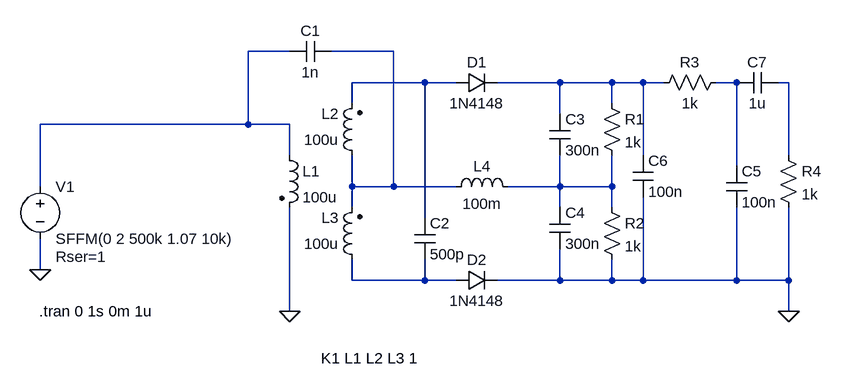
[diagram p0: schematic FMDet.asc]
FMDet.asc, the LTspice schematic file:
Version 4
SHEET 1 1272 680
WIRE 432 -80 368 -80
WIRE 592 -80 496 -80
WIRE 640 -32 528 -32
WIRE 688 -32 640 -32
WIRE 848 -32 752 -32
WIRE 928 -32 848 -32
WIRE 976 -32 928 -32
WIRE 1008 -32 976 -32
WIRE 1120 -32 1088 -32
WIRE 1200 -32 1184 -32
WIRE 528 0 528 -32
WIRE 928 0 928 -32
WIRE 848 16 848 -32
WIRE 368 32 368 -80
WIRE 368 32 48 32
WIRE 432 32 368 32
WIRE 432 80 432 32
WIRE 976 80 976 -32
WIRE 1200 80 1200 -32
WIRE 1120 96 1120 -32
WIRE 48 128 48 32
WIRE 528 128 528 80
WIRE 592 128 592 -80
WIRE 592 128 528 128
WIRE 688 128 592 128
WIRE 848 128 848 80
WIRE 848 128 768 128
WIRE 928 128 928 80
WIRE 928 128 848 128
WIRE 528 160 528 128
WIRE 848 160 848 128
WIRE 928 160 928 128
WIRE 640 176 640 -32
WIRE 48 256 48 208
WIRE 528 272 528 240
WIRE 640 272 640 240
WIRE 640 272 528 272
WIRE 688 272 640 272
WIRE 848 272 848 224
WIRE 848 272 752 272
WIRE 928 272 928 240
WIRE 928 272 848 272
WIRE 976 272 976 144
WIRE 976 272 928 272
WIRE 1120 272 1120 160
WIRE 1120 272 976 272
WIRE 1200 272 1200 160
WIRE 1200 272 1120 272
WIRE 432 320 432 160
WIRE 1200 320 1200 272
FLAG 48 256 0
FLAG 432 320 0
FLAG 1200 320 0
SYMBOL voltage 48 112 R0
WINDOW 123 0 0 Left 2
WINDOW 39 24 124 Left 2
SYMATTR InstName V1
SYMATTR Value SFFM(0 2 500k 1.07 10k)
SYMATTR SpiceLine Rser=1
SYMBOL ind2 416 64 R0
SYMATTR InstName L1
SYMATTR Value 100u
SYMATTR Type ind
SYMBOL ind2 544 96 R180
WINDOW 0 36 80 Left 2
WINDOW 3 36 40 Left 2
SYMATTR InstName L2
SYMATTR Value 100u
SYMATTR Type ind
SYMBOL ind2 544 256 R180
WINDOW 0 36 80 Left 2
WINDOW 3 36 40 Left 2
SYMATTR InstName L3
SYMATTR Value 100u
SYMATTR Type ind
SYMBOL cap 496 -96 R90
WINDOW 0 0 32 VBottom 2
WINDOW 3 32 32 VTop 2
SYMATTR InstName C1
SYMATTR Value 1n
SYMBOL cap 624 176 R0
SYMATTR InstName C2
SYMATTR Value 500p
SYMBOL diode 688 -16 R270
WINDOW 0 32 32 VTop 2
WINDOW 3 0 32 VBottom 2
SYMATTR InstName D1
SYMATTR Value 1N4148
SYMBOL diode 688 288 R270
WINDOW 0 32 32 VTop 2
WINDOW 3 0 32 VBottom 2
SYMATTR InstName D2
SYMATTR Value 1N4148
SYMBOL ind 672 144 R270
WINDOW 0 32 56 VTop 2
WINDOW 3 5 56 VBottom 2
SYMATTR InstName L4
SYMATTR Value 100m
SYMBOL cap 832 16 R0
SYMATTR InstName C3
SYMATTR Value 300n
SYMBOL cap 832 160 R0
SYMATTR InstName C4
SYMATTR Value 300n
SYMBOL res 912 -16 R0
SYMATTR InstName R1
SYMATTR Value 1k
SYMBOL res 912 144 R0
SYMATTR InstName R2
SYMATTR Value 1k
SYMBOL res 1104 -48 R90
WINDOW 0 0 56 VBottom 2
WINDOW 3 32 56 VTop 2
SYMATTR InstName R3
SYMATTR Value 1k
SYMBOL cap 1104 96 R0
SYMATTR InstName C5
SYMATTR Value 100n
SYMBOL res 1184 64 R0
SYMATTR InstName R4
SYMATTR Value 1k
SYMBOL cap 960 80 R0
SYMATTR InstName C6
SYMATTR Value 100n
SYMBOL cap 1184 -48 R90
WINDOW 0 0 32 VBottom 2
WINDOW 3 32 32 VTop 2
SYMATTR InstName C7
SYMATTR Value 1u
TEXT 46 320 Left 2 !.tran 0 1s 0m 1u
TEXT 480 392 Left 2 !K1 L1 L2 L3 1

The netlist it stands for:
* FMDet.asc
V1 N001 0 SFFM(0 2 500k 1.07 10k) Rser=1
L1 N001 0 100u
L2 N002 N003 100u
L3 N008 N002 100u
C1 N002 N001 1n
C2 N003 N008 500p
D1 N003 N004 1N4148
D2 N008 0 1N4148
L4 N002 N007 100m
C3 N004 N007 300n
C4 N007 0 300n
R1 N004 N007 1k
R2 N007 0 1k
R3 N005 N004 1k
C5 N005 0 100n
R4 N006 0 1k
C6 N004 0 100n
C7 N006 N005 1u
.model D D
.lib standard.dio
.tran 0 1s 0m 1u
K1 L1 L2 L3 1
.backanno
.end